# Altium schematic sheet E-O Converter.SchDoc
size 406 x 304 mm; SheetNumber: 3; SheetTotal: 6
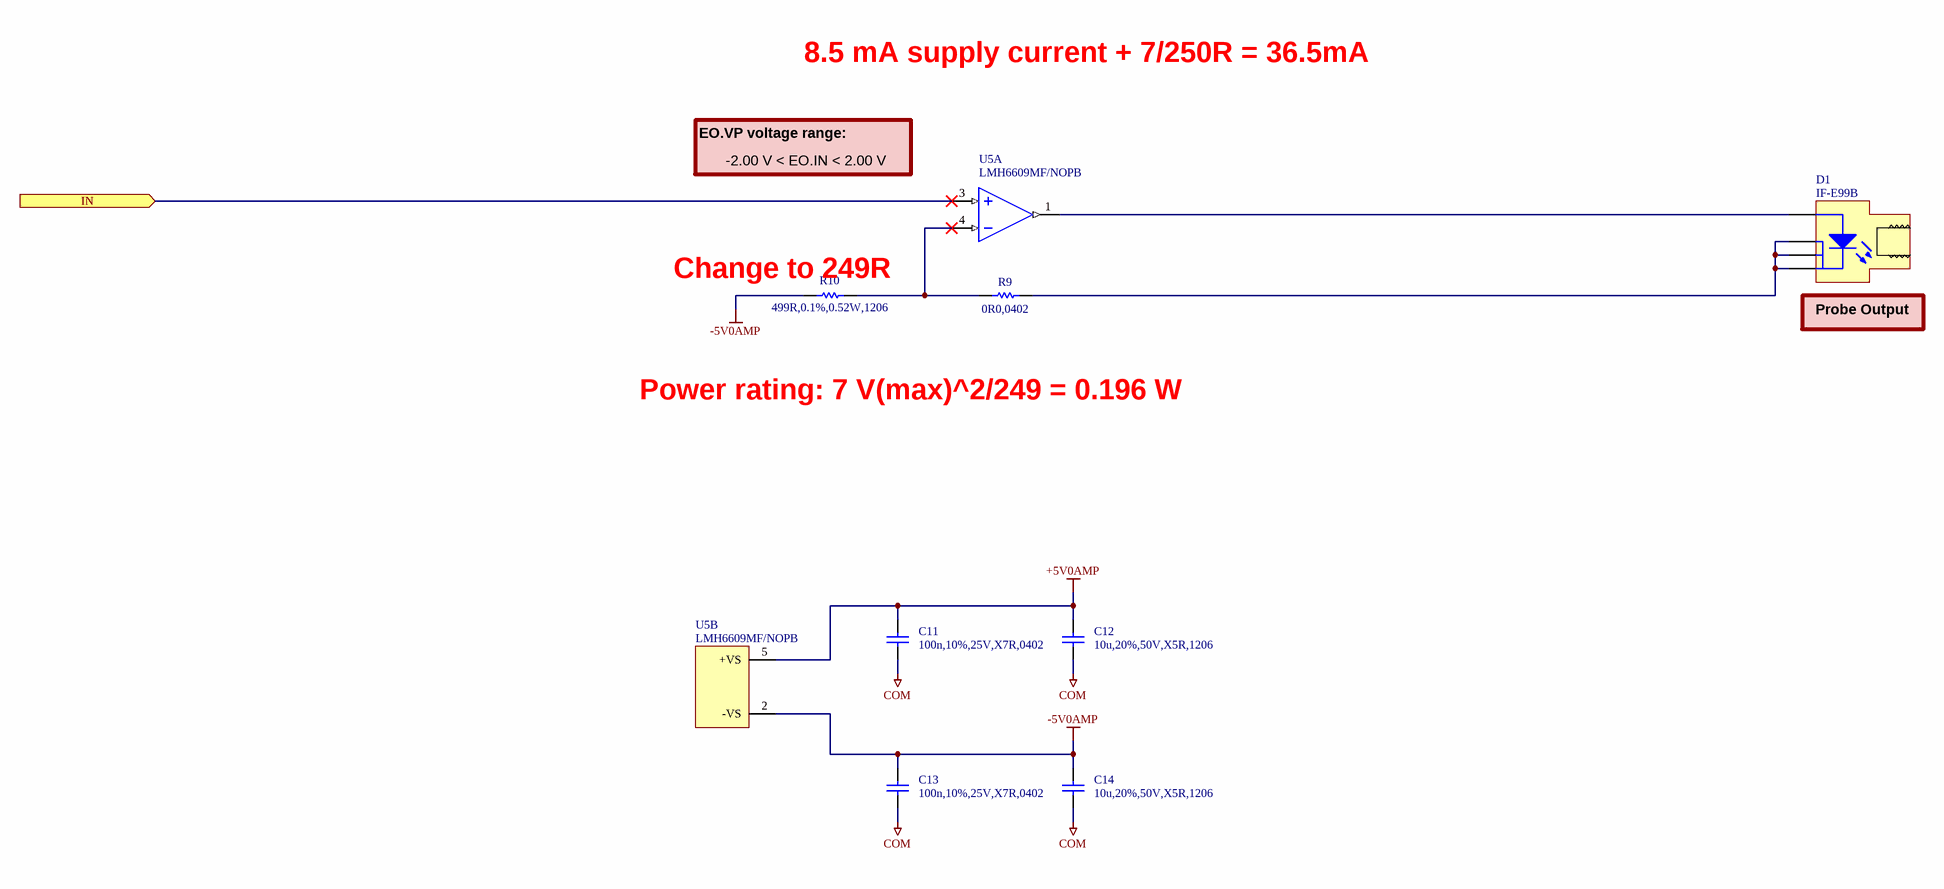
[diagram p0: E-O Converter.SchDoc]

## Parts
C11  100n,10%,25V,X7R,0402  [CAPC1005X06N]
C12  10u,20%,50V,X5R,1206  [CAPC3216X16N]
C13  100n,10%,25V,X7R,0402  [CAPC1005X06N]
C14  10u,20%,50V,X5R,1206  [CAPC3216X16N]
D1  IF-E99B  [INDUSTRIALFIBEROPTICS_IF-E99B]
R9  0R0,0402  [RESC1005X04N]
R10  499R,0.1%,0.52W,1206  [VISHAY_PKG_TNPW1206]
U5  LMH6609MF/NOPB  [TEXASINSTRUMENTS_PKG_DBV0005A]  (parts A,B of 2)

## Ports
IN (in)

## Nets
+5V0AMP: C11.2 C12.2 U5.5(+VS)
-5V0AMP: C13.2 C14.2 R10.1 U5.2(-VS)
COM: C11.1 C12.1 C13.1 C14.1
IN: U5.3(IN+) ; port IN
NetD1_1: D1.1(K) D1.2(K) D1.4(K) R9.2
NetD1_3: D1.3(A) U5.1(OUT1)
NetR9_1: R9.1 R10.2 U5.4(IN-)

## Notes on the sheet
- 8.5 mA supply current + 7/250R = 36.5mA
- EO.VP voltage range:
- -2.00 V < EO.IN < 2.00 V
- (near R10) Change to 249R
- (near D1) Probe Output
- Power rating: 7 V(max)^2/249 = 0.196 W
- Rev
- Sheet Name:
- Date:
- Sheet
- Designer:
- of

## Library data of the parts
C11 C13 = CAP,Cer,100nF,10%,25V,X7R,0402: 0.1ï¿½F ï¿½10% 25V Ceramic Capacitor X7R 0402 (1005 Metric); Manufacturer 1: Murata Electronics; Manufacturer 1 Part Number: GRM155R71E104KE14J; Vendor 1 Part Number: 490-14603-1-ND; Vendor 1: DigiKey; Value: 100nF; Part Name: CAP,Cer,100nF,10%,25V,X7R,0402; CreatedBy: Judd Foster; HelpURL: https://search.murata.co.jp/Ceramy/image/img/A01X/G101/ENG/GRM155R71E104KE14-01.pdf
C12 C14 = CAP,Cer,10uF,50VDC,X5R,1206: 10ï¿½F ï¿½20% 50V Ceramic Capacitor X5R 1206 (3216 Metric); Manufacturer 1: Samsung Electro-Mechanics; Manufacturer 1 Part Number: CL31A106MBHNNNE; Vendor 1 Part Number: 1276-6736-1-ND; Vendor 1: Digikey; Part Name: CAP,Cer,10uF,50VDC,X5R,1206; CreatedBy: Judd Foster; HelpURL: https://www.samsungsem.com/resources/file/global/support/product_catalog/MLCC.pdf; Value: 10u
D1 = XMITTER,FIBER OPTIC,650NM,1.9V,IF-E99B: Fiber Optic Transmitter 650nm 1.9V 50 mA Connector-less; Manufacturer 1: Industrial Fiber Optics; Vendor 1 Part Number: FB161-ND; Vendor 1: DigiKey; Part Name: XMITTER,FIBER OPTIC,650NM,1.9V,IF-E99B; CreatedBy: Judd Foster; HelpURL: https://i-fiberoptics.com/pdf/if-e99bdatasheet.pdf; Manufacturer 1 Part Number: IF-E99B
R9 = RES,0R0,0402: 0 Ohms Jumper 0.1W, 1/10W Chip Resistor 0402 (1005 Metric) Automotive AEC-Q200 Thick Film; Manufacturer 1: Panasonic Electronic Components; Manufacturer 1 Part Number: ERJ-2GE0R00X; Vendor 1 Part Number: P0.0JCT-ND; Vendor 1: Digikey; Value: 0; Part Name: RES,0R0,0402; CreatedBy: Judd Foster; HelpURL: https://industrial.panasonic.com/cdbs/www-data/pdf/RDA0000/AOA0000C301.pdf
R10 = RES,499R,0.1%,0.52W,1206: 499 Ohms Â±0.1% 0.52W Chip Resistor 1206 (3216 Metric) Anti-Sulfur, Automotive AEC-Q200, Moisture Resistant Thin Film; Manufacturer 1: Vishay Dale; Manufacturer 1 Part Number: TNPW1206499RBEEA; Vendor 1 Part Number: 541-3877-1-ND; Vendor 1: DigiKey; Part Name: RES,499R,0.1%,0.52W,1206; CreatedBy: Judd Foster; HelpURL: https://www.vishay.com/docs/28758/tnpw_e3.pdf; Value: 499R
U5 = LMH6609MF_NOPB: Voltage Feedback Amplifier 1 Circuit SOT-23-5; Manufacturer 1: Texas Instruments; Vendor 1 Part Number: LMH6609MF/NOPBCT-ND; Vendor 1: DigiKey; Part Name: LMH6609MF_NOPB; CreatedBy: Judd Foster; HelpURL: https://www.ti.com/lit/ds/symlink/lmh6609.pdf; Manufacturer 1 Part Number: LMH6609MF/NOPB